# Altium schematic sheet smartGarden_Driver_Rev01.SchDoc
size A
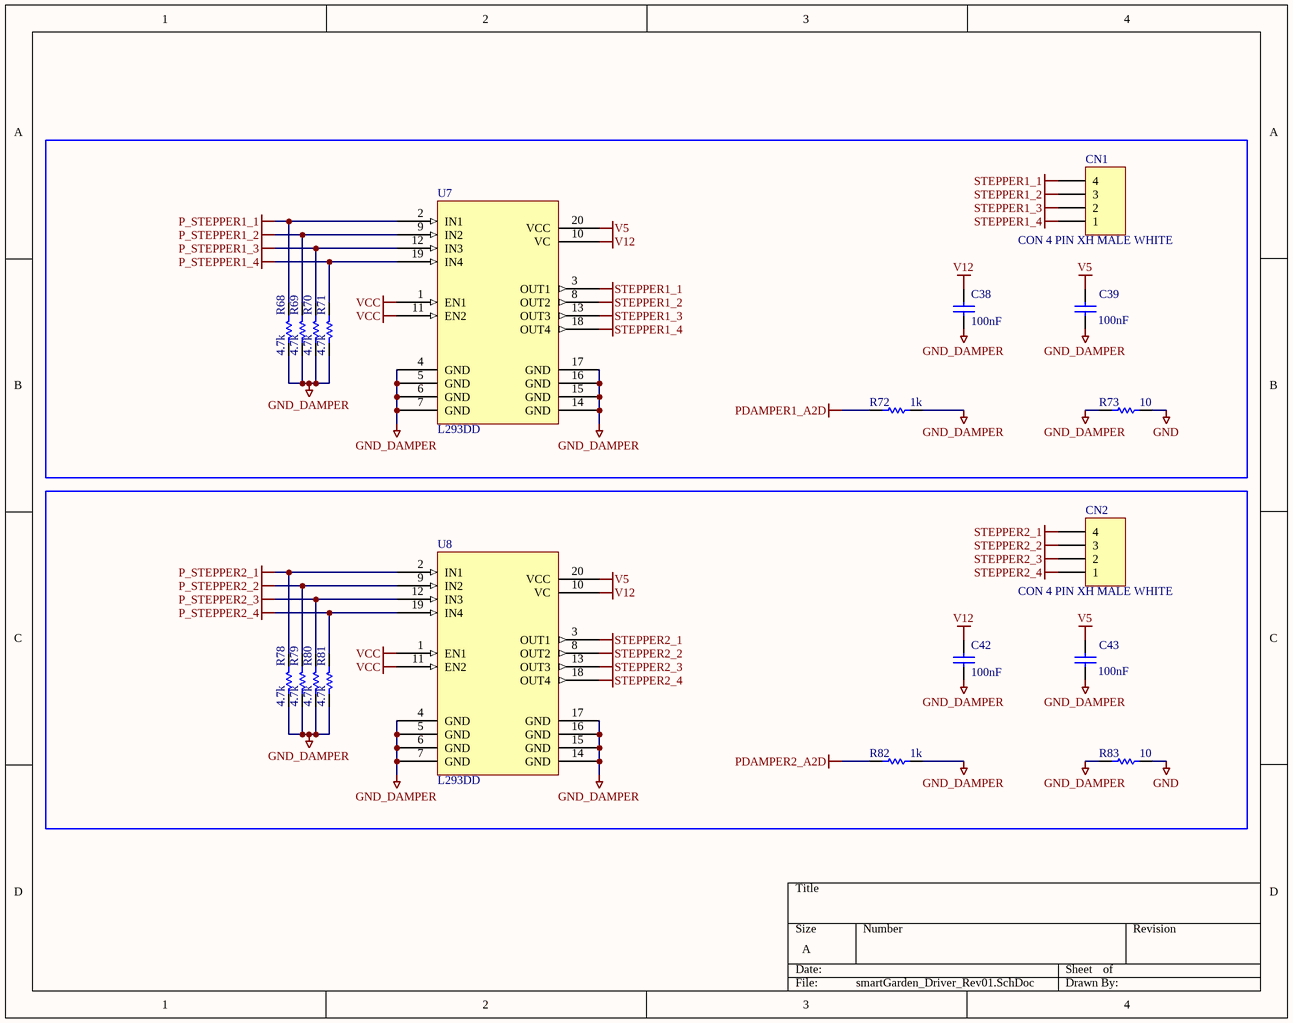
[diagram p0: smartGarden_Driver_Rev01.SchDoc]

## Parts
C38  100nF  [0805_SMD]
C39  100nF  [0805_SMD]
C42  100nF  [0805_SMD]
C43  100nF  [0805_SMD]
CN1  CON 4 PIN XH MALE WHITE  [CON4_XH]
CN2  CON 4 PIN XH MALE WHITE  [CON4_XH]
R68  4.7k  [1206_smd]
R69  4.7k  [0805_smd]
R70  4.7k  [0805_smd]
R71  4.7k  [1206_smd]
R72  1k  [1206_smd]
R73  10  [1206_smd]
R78  4.7k  [1206_smd]
R79  4.7k  [0805_smd]
R80  4.7k  [0805_smd]
R81  4.7k  [1206_smd]
R82  1k  [1206_smd]
R83  10  [1206_smd]
U7  L293DD  [SOP20]
U8  L293DD  [SOP20]

## Nets
GND: R73.1 R83.1
GND_DAMPER: C38.1 C39.1 C42.1 C43.1 R68.1 R69.1 R70.1 R71.1 R72.1 R73.2 R78.1 R79.1 R80.1 R81.1 R82.1 R83.2 U7.4(GND) U7.5(GND) U7.6(GND) U7.7(GND) U7.14(GND) U7.15(GND) U7.16(GND) U7.17(GND) U8.4(GND) U8.5(GND) U8.6(GND) U8.7(GND) U8.14(GND) U8.15(GND) U8.16(GND) U8.17(GND)
P_STEPPER1_1: R68.2 U7.2(IN1)
P_STEPPER1_2: R69.2 U7.9(IN2)
P_STEPPER1_3: R70.2 U7.12(IN3)
P_STEPPER1_4: R71.2 U7.19(IN4)
P_STEPPER2_1: R78.2 U8.2(IN1)
P_STEPPER2_2: R79.2 U8.9(IN2)
P_STEPPER2_3: R80.2 U8.12(IN3)
P_STEPPER2_4: R81.2 U8.19(IN4)
PDAMPER1_A2D: R72.2
PDAMPER2_A2D: R82.2
STEPPER1_1: CN1.4 U7.3(OUT1)
STEPPER1_2: CN1.3 U7.8(OUT2)
STEPPER1_3: CN1.2 U7.13(OUT3)
STEPPER1_4: CN1.1 U7.18(OUT4)
STEPPER2_1: CN2.4 U8.3(OUT1)
STEPPER2_2: CN2.3 U8.8(OUT2)
STEPPER2_3: CN2.2 U8.13(OUT3)
STEPPER2_4: CN2.1 U8.18(OUT4)
V5: C39.2 C43.2 U7.20(VCC) U8.20(VCC)
V12: C38.2 C42.2 U7.10(VC) U8.10(VC)
VCC: U7.1(EN1) U7.11(EN2) U8.1(EN1) U8.11(EN2)

## Library data of the parts
C38 C39 C42 C43 = Cap Semi: Capacitor (Semiconductor SIM Model); Value: ??; Published: 8-Jun-2000; LatestRevisionDate: 17-Jul-2002; LatestRevisionNote: Re-released for DXP Platform.; PackageReference: C1206; Publisher: Altium Limited
CN1 CN2 = Header 4: Header, 4-Pin; LatestRevisionDate: 17-Jul-2002; LatestRevisionNote: Re-released for DXP Platform.; Publisher: Altium Limited
R68-R72 R78-R82 = Res1: Resistor; Published: 8-Jun-2000; LatestRevisionDate: 17-Jul-2002; LatestRevisionNote: Re-released for DXP Platform.; PackageReference: AXIAL-0.3; Publisher: Altium Limited
  R72 R82: Value: 1k
R73 R83 = Res1: Resistor; Value: 1k; Published: 8-Jun-2000; LatestRevisionDate: 17-Jul-2002; LatestRevisionNote: Re-released for DXP Platform.; PackageReference: AXIAL-0.3; Publisher: Altium Limited